# Altium project WSN.PrjPCB
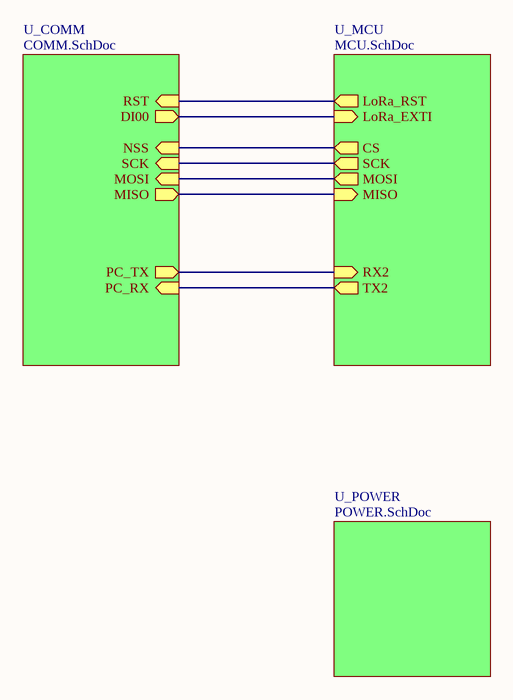
[diagram p0: CONN.SchDoc]
4 sheets, 48 parts. Net scope: hierarchical (ports join the sheet entries above them; power ports are global).
Board file: WSN_PCB.PcbDoc
Sheets:
  CONN.SchDoc
    U_COMM = COMM.SchDoc
    U_MCU = MCU.SchDoc
    U_POWER = POWER.SchDoc

## Sheet CONN.SchDoc: =ProjectName
size A4; CheckedBy: DatNB; Author: Ven; CompanyName: Nacentech; Organization: IMET

### Sub-sheets
U_COMM = COMM.SchDoc: PC_TX (out), PC_RX (in), MOSI (in), MISO (out), NSS (in), RST (in), SCK (in), DI00 (out)
U_MCU = MCU.SchDoc: RX2 (in), TX2 (out), MOSI (out), MISO (in), SCK (out), LoRa_RST (out), CS (out), LoRa_EXTI (in)
U_POWER = POWER.SchDoc: no entries

### Nets
GPIO14: sheet U_COMM/NSS, sheet U_MCU/CS
GPIO16: sheet U_COMM/PC_TX, sheet U_MCU/RX2
GPIO17: sheet U_COMM/PC_RX, sheet U_MCU/TX2
GPIO18: sheet U_COMM/SCK, sheet U_MCU/SCK
GPIO19: sheet U_COMM/MISO, sheet U_MCU/MISO
GPIO23: sheet U_COMM/MOSI, sheet U_MCU/MOSI
GPIO32: sheet U_COMM/DI00, sheet U_MCU/LoRa_EXTI
GPIO33: sheet U_COMM/RST, sheet U_MCU/LoRa_RST

### Notes on the sheet
- Project:
- Page Contents:
- Size:
- Date:
- A4
- Checked by:
- Time:
- Revision:
- Sheet
- of
- File:

## Sheet COMM.SchDoc: =ProjectName
size A4; CheckedBy: DatNB; Author: Ven; CompanyName: Nacentech; Organization: IMET
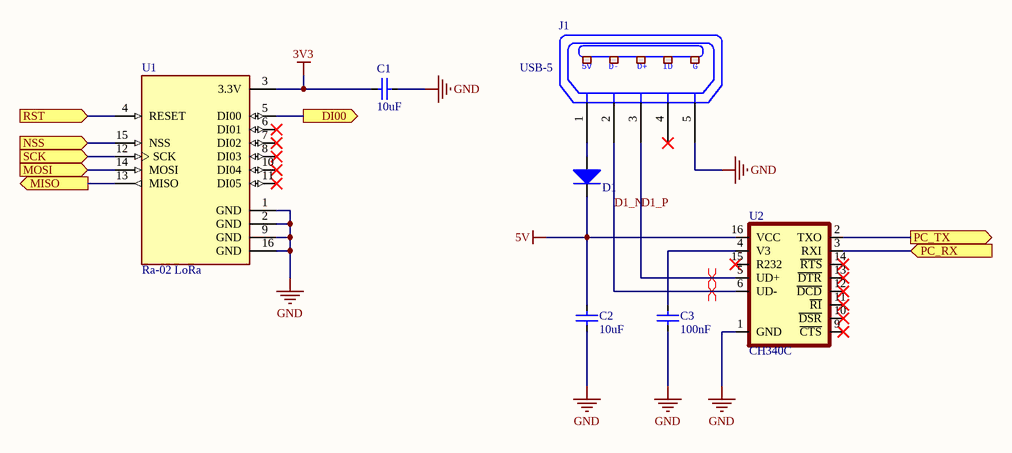
[diagram p1: COMM.SchDoc]

### Parts
C1  10uF  [CAP_0805]
C2  10uF  [CAP_0805]
C3  100nF  [CAP_0805]
D1  Diode SMD  [DIO-214AC(SMA)]  (value not drawn)
J1  USB-5  [USB-M1]
U1  Ra-02 LoRa  [Ra-02]
U2  CH340C  [SOP-16]

### Ports
DI00 (out), MISO (out), MOSI (in), NSS (in), PC_RX (in), PC_TX (out), RST (in), SCK (in)

### Nets
3V3: C1.2 U1.3(3.3V)
5V: C2.2 D1.2(K) U2.16(VCC)
GND: C1.1 C2.1 C3.1 J1.5(P5) U1.1(GND) U1.2(GND) U1.9(GND) U1.16(GND) U2.1(GND)
D1_N: J1.2(P2) U2.6(UD-)
D1_P: J1.3(P3) U2.5(UD+)
GPIO14: U1.15(NSS) ; port NSS
GPIO16: U2.2(TXO) ; port PC_TX
GPIO17: U2.3(RXI) ; port PC_RX
GPIO18: U1.12(SCK) ; port SCK
GPIO19: U1.13(MISO) ; port MISO
GPIO23: U1.14(MOSI) ; port MOSI
GPIO32: U1.5(DI00) ; port DI00
GPIO33: U1.4(RESET) ; port RST
NetC3_2: C3.2 U2.4(V3)
NetD1_1: D1.1(A) J1.1(P1)

Not connected (* = marked no-connect by the designer): J1 4(P4)*; U1 6(DI01)* 7(DI02)* 8(DI03)* 10(DI04)* 11(DI05)*; U2 9(~{CTS})* 10(~{DSR})* 11(~{RI})* 12(~{DCD})* 13(~{DTR})* 14(~{RTS})* 15(R232)*

### Layout directives
differential pair: D1_N, D1_P

### Notes on the sheet
- Project:
- Page Contents:
- Size:
- Date:
- A4
- Checked by:
- Time:
- Revision:
- Sheet
- of
- File:
- (in symbol USB-5) 5V; D-; D+; ID; G

### Library data of the parts
C1-C3 = CapSMD: Capacitor; Value: 33p; Published: 8-Jun-2000; LatestRevisionDate: 17-Jul-2002; LatestRevisionNote: Re-released for DXP Platform.; PackageReference: RAD-0.3; Publisher: Altium Limited
D1 = Diode SMD: Default Diode; Code - JEDEC: DO-214-AB; Value: 1N5007; Published: 8-Jun-2000; Revision: July-2002: Re-released for DXP Platform.; Publisher: Altium Limited
J1 = USB-5: Manufacturer: FCI; Manufacturer Part Number: 10118193-0001LF; Connector Type: USB - micro B; Number of Contacts: 5; Gender: Receptacle; Specifications: USB 2.0; .Creator: MM; .Checked PCB: RF; Supplier 1: Digi-Key; RoHS: RoHS Compliant; Category: Connectors, Interconnects; Stock 1: 28642; Pricing 1: 1=0.46, 10=0.433, 25=0.3712, 50=0.3156, 100=0.3032, 250=0.27224, 500=0.25988 (USD); Packaging: Cut Tape (CT); Mounting Type: Surface Mount, Right Angle, Horizontal; Features: Shielded, Solder Retention; Ingress Protection: -; ComponentLink1URL: http://portal.fciconnect.com/Comergent//fci/drawing/10118193.pdf; ComponentLink1Description: http://portal.fciconnect.com/Comergent//fci/drawing/10118193.pdf; Supplier Part Number 1: 609-4616-1-ND; .Checked SCH: MM
U1 = Ra-02 LoRa: LoRa Module Ra-02
U2 = CH340C: USB to serial chip CH340; MF: WCH; Package: Package; Check_prices: https://www.snapeda.com/parts/CH340C/WCH/view-part/5428851/?ref=eda; Value: *; Price: None; MP: CH340C; Availability: Unavailable; SnapEDA_Link: https://www.snapeda.com/parts/CH340C/WCH/view-part/5428851/?ref=snap

## Sheet MCU.SchDoc: =ProjectName
size A4; CheckedBy: DatNB; Author: Ven; CompanyName: Nacentech; Organization: IMET
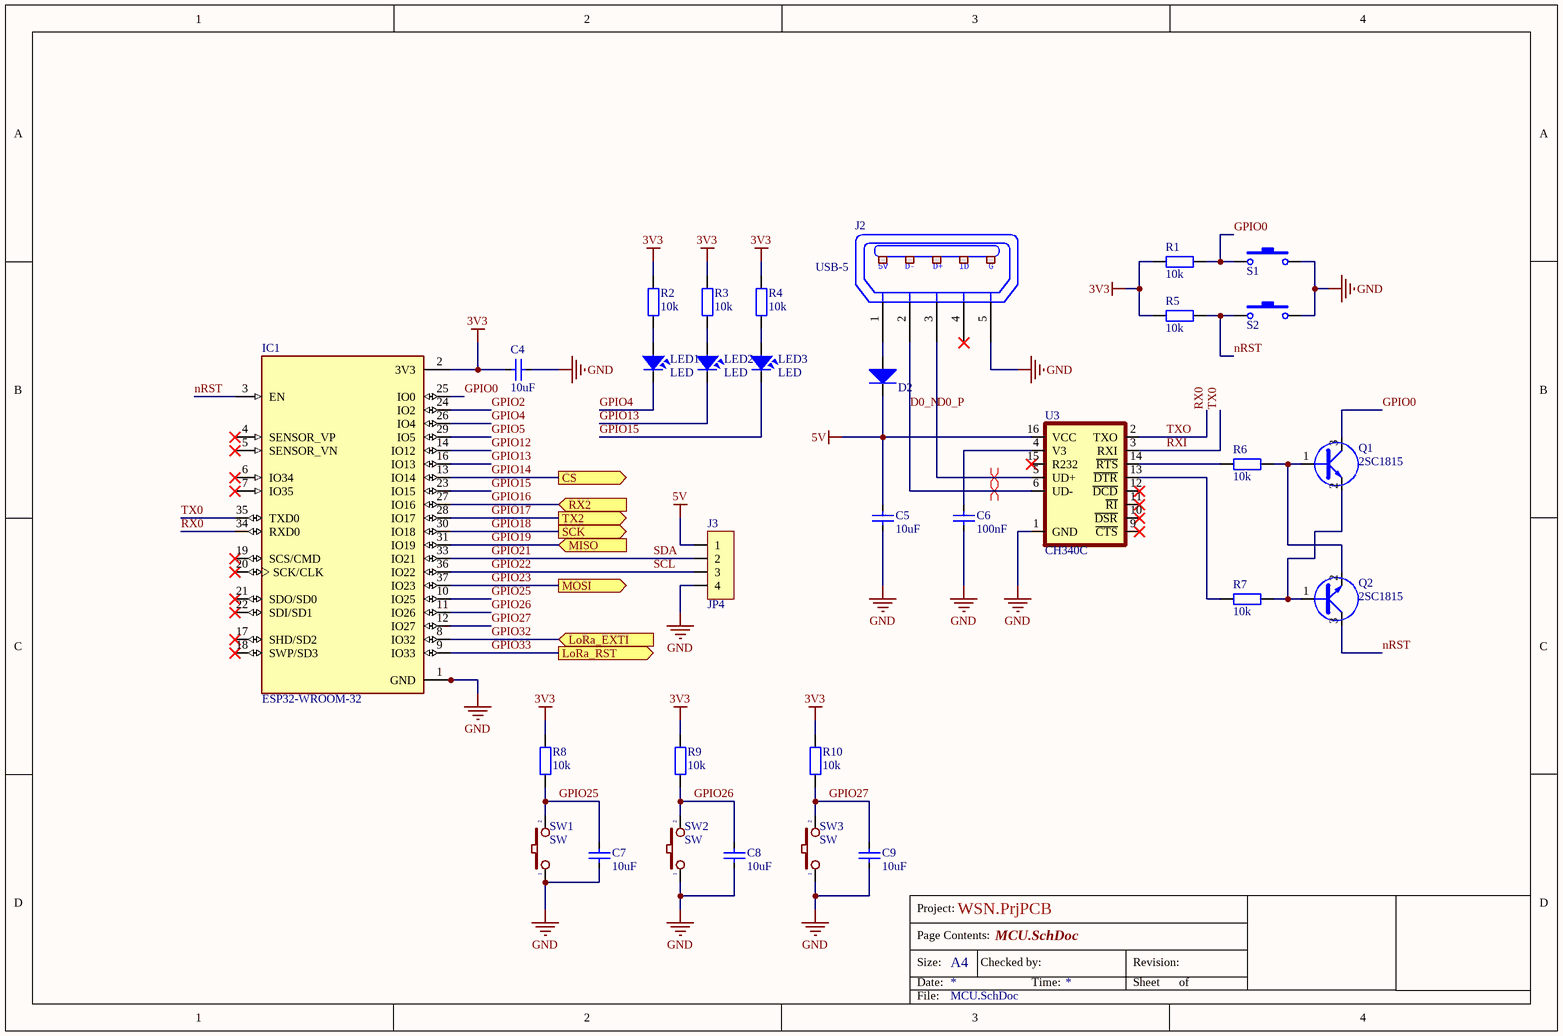
[diagram p2: MCU.SchDoc]

### Parts
C4  10uF  [CAP_0805]
C5  10uF  [CAP_0805]
C6  100nF  [CAP_0805]
C7  10uF  [CAP_0805]
C8  10uF  [CAP_0805]
C9  10uF  [CAP_0805]
D2  Diode SMD  [DIO-214AC(SMA)]  (value not drawn)
IC1  ESP32-WROOM-32  [MODULE_ESP32-WROOM-32]
J2  USB-5  [USB-M1]
J3  JP4  [JP4-C1T]
LED1  LED  [LED-0805-Orange]
LED2  LED  [LED-0805-Orange]
LED3  LED  [LED-0805-Orange]
Q1  2SC1815  [SOT23D]
Q2  2SC1815  [SOT23D]
R1  10k  [RES-SMD-0805]
R2  10k  [RES-SMD-0805]
R3  10k  [RES-SMD-0805]
R4  10k  [RES-SMD-0805]
R5  10k  [RES-SMD-0805]
R6  10k  [RES-SMD-0805]
R7  10k  [RES-SMD-0805]
R8  10k  [RES-SMD-0805]
R9  10k  [RES-SMD-0805]
R10  10k  [RES-SMD-0805]
S1  SW-SMD  [SW 3x2x4]  (value not drawn)
S2  SW-SMD  [SW 3x2x4]  (value not drawn)
SW1  SW  [SW2]
SW2  SW  [SW2]
SW3  SW  [SW2]
U3  CH340C  [SOP-16]

### Ports
CS (out), LoRa_EXTI (in), LoRa_RST (out), MISO (in), MOSI (out), RX2 (in), SCK (out), TX2 (out)

### Nets
3V3: C4.2 IC1.2(3V3) R1.2 R2.1 R3.1 R4.1 R5.2 R8.1 R9.1 R10.1
5V: C5.2 D2.2(K) J3.1 U3.16(VCC)
GND: C4.1 C5.1 C6.1 C7.1 C8.1 C9.1 IC1.1(GND) IC1.15(GND) IC1.38(GND) IC1.39_1(GND) IC1.39_2(GND) IC1.39_3(GND) IC1.39_4(GND) IC1.39_5(GND) IC1.39_6(GND) IC1.39_7(GND) IC1.39_8(GND) IC1.39_9(GND) IC1.39_10(GND) IC1.39_11(GND) IC1.39_12(GND) IC1.39_13(GND) IC1.39_14(GND) IC1.39_15(GND) IC1.39_16(GND) IC1.39_17(GND) IC1.39_18(GND) IC1.39_19(GND) IC1.39_20(GND) IC1.39_21(GND) J2.5(P5) J3.4 S1.2 S2.2 SW1.1 SW2.1 SW3.1 U3.1(GND)
D0_N: J2.2(P2) U3.6(UD-)
D0_P: J2.3(P3) U3.5(UD+)
GPIO0: IC1.25(IO0) Q1.3(C) R1.1 S1.1
GPIO2: IC1.24(IO2)
GPIO4: IC1.26(IO4) LED1.2
GPIO5: IC1.29(IO5)
GPIO12: IC1.14(IO12)
GPIO13: IC1.16(IO13) LED2.2
GPIO14: IC1.13(IO14) ; port CS
GPIO15: IC1.23(IO15) LED3.2
GPIO16: IC1.27(IO16) ; port RX2
GPIO17: IC1.28(IO17) ; port TX2
GPIO18: IC1.30(IO18) ; port SCK
GPIO19: IC1.31(IO19) ; port MISO
GPIO21: IC1.33(IO21) J3.2  [also labelled SDA]
GPIO22: IC1.36(IO22) J3.3  [also labelled SCL]
GPIO23: IC1.37(IO23) ; port MOSI
GPIO25: C7.2 IC1.10(IO25) R8.2 SW1.2
GPIO26: C8.2 IC1.11(IO26) R9.2 SW2.2
GPIO27: C9.2 IC1.12(IO27) R10.2 SW3.2
GPIO32: IC1.8(IO32) ; port LoRa_EXTI
GPIO33: IC1.9(IO33) ; port LoRa_RST
nRST: IC1.3(EN) Q2.3(C) R5.1 S2.1
RX0: IC1.34(RXD0) U3.2(TXO)  [also labelled TXO]
RXI: IC1.35(TXD0) U3.3(RXI)  [also labelled TX0]
NetC6_2: C6.2 U3.4(V3)
NetD2_1: D2.1(A) J2.1(P1)
NetLED1_1: LED1.1 R2.2
NetLED2_1: LED2.1 R3.2
NetLED3_1: LED3.1 R4.2
NetQ1_1: Q1.1(B) Q2.2(E) R6.1
NetQ1_2: Q1.2(E) Q2.1(B) R7.1
NetR6_2: R6.2 U3.14(~{RTS})
NetR7_2: R7.2 U3.13(~{DTR})

Not connected (* = marked no-connect by the designer): IC1 4(SENSOR_VP)* 5(SENSOR_VN)* 6(IO34)* 7(IO35)* 17(SHD/SD2)* 18(SWP/SD3)* 19(SCS/CMD)* 20(SCK/CLK)* 21(SDO/SD0)* 22(SDI/SD1)*; J2 4(P4)*; U3 9(~{CTS})* 10(~{DSR})* 11(~{RI})* 12(~{DCD})* 15(R232)*

### Layout directives
differential pair: D0_N, D0_P

### Notes on the sheet
- Project:
- Page Contents:
- Size:
- Date:
- A4
- Checked by:
- Time:
- Revision:
- Sheet
- of
- File:
- (in symbol USB-5) 5V; D-; D+; ID; G

### Library data of the parts
C4-C9 = CapSMD: Capacitor; Value: 33p; Published: 8-Jun-2000; LatestRevisionDate: 17-Jul-2002; LatestRevisionNote: Re-released for DXP Platform.; PackageReference: RAD-0.3; Publisher: Altium Limited
D2 = Diode SMD: as D1 on sheet COMM; Published: 8-Jun-2000; Revision: July-2002: Re-released for DXP Platform.; Publisher: Altium Limited
IC1 = ESP32-WROOM-32: Bluetooth, WiFi Transceiver Module 2.4GHz ~ 2.5GHz Surface Mount; MF: Espressif Systems; Package: Module Espressif Systems; Digi-Key_Part_Number: 1904-1010-1-ND; Digi-Key_Purchase_URL: https://www.digikey.com/product-detail/en/espressif-systems/ESP32-WROOM-32/1904-1010-1-ND/8544305?utm_source=snapeda&utm_medium=aggregator&utm_campaign=symbol; Value: *; MP: ESP32-WROOM-32; SnapEDA_Link: https://www.snapeda.com/parts/ESP32-WROOM-32/Espressif%20Systems/view-part/2753322/?ref=snap
J2 = USB-5: as J1 on sheet COMM; Supplier 1: Digi-Key; RoHS: RoHS Compliant; Category: Connectors, Interconnects; Stock 1: 28642; Pricing 1: 1=0.46, 10=0.433, 25=0.3712, 50=0.3156, 100=0.3032, 250=0.27224, 500=0.25988 (USD); Packaging: Cut Tape (CT); Mounting Type: Surface Mount, Right Angle, Horizontal; Features: Shielded, Solder Retention; Ingress Protection: -; ComponentLink1URL: http://portal.fciconnect.com/Comergent//fci/drawing/10118193.pdf; ComponentLink1Description: http://portal.fciconnect.com/Comergent//fci/drawing/10118193.pdf; Supplier Part Number 1: 609-4616-1-ND; .Checked SCH: MM
J3 = JP4: WR-PHD 2.54 mm Angled Socket Header; Manufacturer: W¨¹rth Elektronik eiSos GmbH; partNo: 613004143121; ComponentLink1 Description: Manufacturer; ComponentLink2 Description: Datasheet; NoPins: 04; Created Date: 29 March 2013; ComponentLink1URL: http://www.we-online.com; ComponentLink2URL: http://katalog.we-online.de/em/datasheet/6130xx143121.pdf; Created by: Karrer Zheng
LED1-LED3 = LED: LED Single colour Green and Red; Value: LED 3 ly Single Colour
Q1 Q2 = C1815: NPN 600mW, ECB; Value: C1815
R1-R10 = Resistor - SMD: Resistor SMD; Manufacturer: Generic Components; Class: Passive; Published: 08/06/2000; Publisher: Altium Hobart Technology Centre
S1 S2 = SW-SMD: Switch; Published: 24-Mar-1999; LatestRevisionDate: 17-Jul-2002; LatestRevisionNote: Re-released for DXP Platform.; PackageReference: SPST-2; Publisher: Altium Limited
SW1-SW3 = SW2: Switch button 2 pin; Value: SW chip 2 pin
U3 = CH340C: USB to serial chip CH340; MF: WCH; Package: Package; Check_prices: https://www.snapeda.com/parts/CH340C/WCH/view-part/5428851/?ref=eda; Value: *; Price: None; MP: CH340C; Availability: Unavailable; SnapEDA_Link: https://www.snapeda.com/parts/CH340C/WCH/view-part/5428851/?ref=snap

## Sheet POWER.SchDoc: =ProjectName
size A4; CheckedBy: DatNB; Author: Ven; CompanyName: Nacentech; Organization: IMET
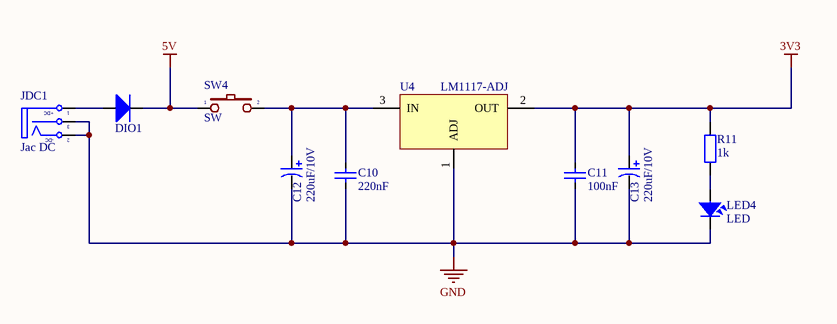
[diagram p3: POWER.SchDoc]

### Parts
C10  220nF  [CAP_0805]
C11  100nF  [CAP_0805]
C12  220uF/10V  [CAP_7343]
C13  220uF/10V  [CAP_7343]
DIO1  Diode SMD  [DIO-214AC(SMA)]  (value not drawn)
JDC1  Jac DC  [DC-IN]
LED4  LED  [LED-0805-Red]
R11  1k  [RES-SMD-0805]
SW4  SW  [SW2]
U4  LM1117-ADJ  [LM1117-SOP]

### Nets
3V3: C11.2 C13.1 R11.1 U4.2(OUT)
5V: DIO1.2(K) SW4.1
GND: C10.1 C11.1 C12.2 C13.2 JDC1.2(TN) JDC1.3(S) LED4.2 U4.1(ADJ)
NetC10_2: C10.2 C12.1 SW4.2 U4.3(IN)
NetDIO1_1: DIO1.1(A) JDC1.1(T)
NetLED4_1: LED4.1 R11.2

### Notes on the sheet
- Project:
- Page Contents:
- Size:
- Date:
- A4
- Checked by:
- Time:
- Revision:
- Sheet
- of
- File:
- (in symbol DCIN) +DC; -DC

### Library data of the parts
C10 C11 = CapSMD: Capacitor; Value: 33p; Published: 8-Jun-2000; LatestRevisionDate: 17-Jul-2002; LatestRevisionNote: Re-released for DXP Platform.; PackageReference: RAD-0.3; Publisher: Altium Limited
C12 C13 = CAP_TAN_SMD: Polazied Tantalum Capacitor
DIO1 = Diode SMD: as D1 on sheet COMM; Published: 8-Jun-2000; Revision: July-2002: Re-released for DXP Platform.; Publisher: Altium Limited
JDC1 = DCIN: Jac DC input; Value: Jac DC
LED4 = LED: as LED1 on sheet MCU
R11 = Resistor - SMD: as R1 on sheet MCU; Published: 08/06/2000; Publisher: Altium Hobart Technology Centre
SW4 = SW2: as SW1 on sheet MCU
U4 = LM1117-ADJ: 800mA Low-Dropout Linear Regulator; Creator: Nguyen Ba Bien; Website: http://group3i.net

## Nets that join several sheets
3V3: COMM (C1.2 U1.3), MCU (10 pins), POWER (C11.2 C13.1 R11.1 U4.2)
5V: COMM (C2.2 D1.2 U2.16), MCU (C5.2 D2.2 J3.1 U3.16), POWER (DIO1.2 SW4.1)
GND: COMM (9 pins), MCU (38 pins), POWER (8 pins)
GPIO14: COMM (U1.15), MCU (IC1.13)
GPIO16: COMM (U2.2), MCU (IC1.27)
GPIO17: COMM (U2.3), MCU (IC1.28)
GPIO18: COMM (U1.12), MCU (IC1.30)
GPIO19: COMM (U1.13), MCU (IC1.31)
GPIO23: COMM (U1.14), MCU (IC1.37)
GPIO32: COMM (U1.5), MCU (IC1.8)
GPIO33: COMM (U1.4), MCU (IC1.9)